# Altium schematic sheet Power.SchDoc
size A3
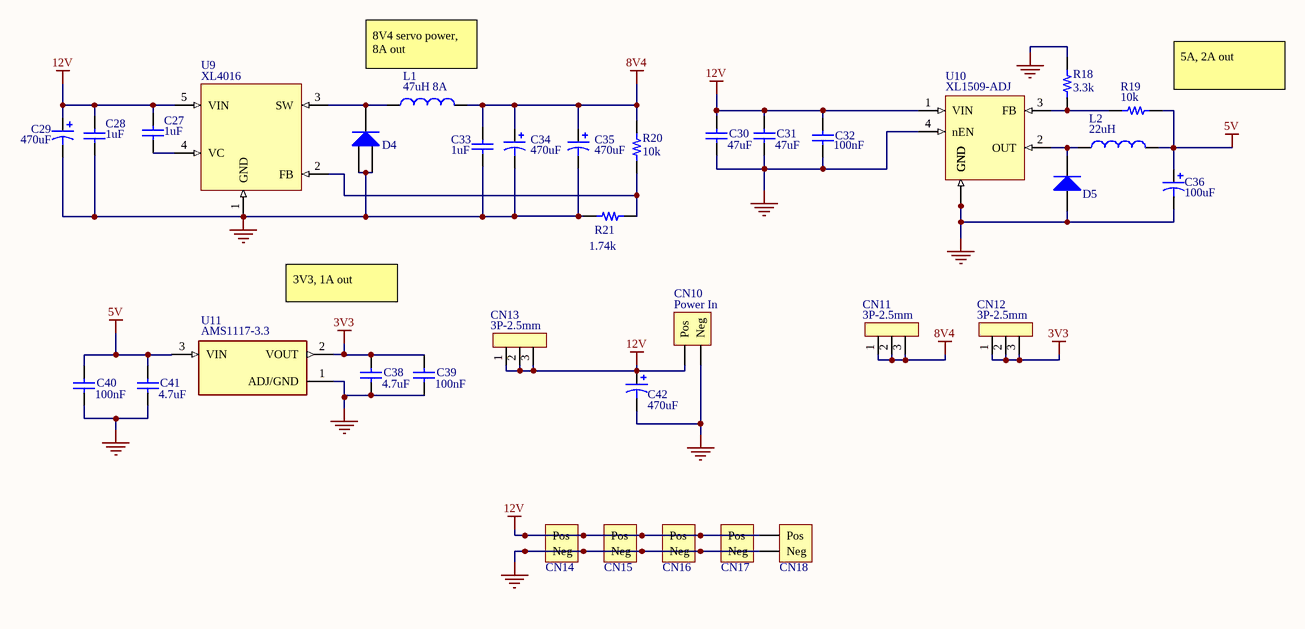
[diagram p0: Power.SchDoc]

## Parts
C27  value 1uF  [0402]  (hidden comment: Cap)
C28  value 1uF  [0402]  (hidden comment: Cap)
C29  470uF  [10x12mm-Electrolytic]
C30  value 47uF  [1206]  (hidden comment: Cap)
C31  value 47uF  [1206]  (hidden comment: Cap)
C32  value 100nF  [0402]  (hidden comment: Cap)
C33  value 1uF  [0402]  (hidden comment: Cap)
C34  470uF  [10x12mm-Electrolytic]
C35  470uF  [10x12mm-Electrolytic]
C36  100uF  [10x12mm-Electrolytic]
C38  value 4.7uF  [0805 - duplicate]  (hidden comment: Cap)
C39  value 100nF  [0402]  (hidden comment: Cap)
C40  value 100nF  [0402]  (hidden comment: Cap)
C41  value 4.7uF  [0805 - duplicate]  (hidden comment: Cap)
C42  470uF  [10x12mm-Electrolytic]
CN10  Power In  [Power_Leads]
CN11  3P-2.5mm  [2.5mm-3P]
CN12  3P-2.5mm  [2.5mm-3P]
CN13  3P-2.5mm  [2.5mm-3P]
CN14  JST_Leads_In  [Power_Leads]  (value not drawn)
CN15  JST_Leads_In  [Power_Leads]  (value not drawn)
CN16  JST_Leads_In  [Power_Leads]  (value not drawn)
CN17  JST_Leads_In  [Power_Leads]  (value not drawn)
CN18  JST_Leads_In  [Power_Leads]  (value not drawn)
D4  Diode  [PowerDi5]  (value not drawn)
D5  SS24  [DO-214AA]  (value not drawn)
L1  47uH 8A  [18x16-9-Inductor]
L2  22uH  [71x66-Inductor]
R18  3.3k  [0805 - duplicate]
R19  10k  [0805 - duplicate]
R20  10k  [0805 - duplicate]
R21  1.74k  [0805 - duplicate]
U9  XL4016  [TO220-5L]
U10  XL1509-ADJ  [SOP8-MT3420]
U11  AMS1117-3.3  [SOT229P700X180-4N]

## Nets
3V3: C38.2 C39.2 CN12.1 CN12.2 CN12.3 U11.2(VOUT)
5V: C36.1 C40.2 C41.2 L2.2 R19.2 U11.3(VIN)
8V4: C33.2 C34.1 C35.1 CN11.1 CN11.2 CN11.3 L1.2 R20.2
12V: C27.2 C28.2 C29.1 C30.2 C31.2 C32.2 C42.1 CN10.A(Pos) CN13.1 CN13.2 CN13.3 CN14.A(Pos) CN15.A(Pos) CN16.A(Pos) CN17.A(Pos) CN18.A(Pos) U9.5(VIN) U10.1(VIN)
GND: C28.1 C29.2 C30.1 C31.1 C32.1 C33.1 C34.2 C35.2 C36.2 C38.1 C39.1 C40.1 C41.1 C42.2 CN10.K(Neg) CN14.K(Neg) CN15.K(Neg) CN16.K(Neg) CN17.K(Neg) CN18.K(Neg) D4.1(A) D4.2(A) D5.A R18.2 R21.1 U9.1(GND) U10.4(nEN) U10.5(GND) U10.6(GND) U10.7(GND) U10.8(GND) U11.1(ADJ/GND)
NetC27_1: C27.1 U9.4(VC)
NetD4_3: D4.3(K) L1.1 U9.3(SW)
NetD5_K: D5.K L2.1 U10.2(OUT)
NetR18_1: R18.1 R19.1 U10.3(FB)
NetR20_1: R20.1 R21.2 U9.2(FB)

## Notes on the sheet
- (near L1) 8V4 servo power, 8A out
- (near R19) 5A, 2A out
- 3V3, 1A out

## Library data of the parts
C29 C34-C36 C42 = Polarised Capacitor
CN10 = JST_Leads_In
D5 = SS24: 2A Schottky Diode
L1 = SMD Inductor 18x16.9: TMPC1707
L2 = 22uH Inductor, 7.1*6.6
R18-R21 = Resistor
U9 = XL4016: 8A Buck COnverter
U10 = XL1509-5
U11 = AMS1117-3.3: Sot223/Pkg 1-Amp 3.3-Volt Low Drop Out Voltage Regulatator; MF: Advanced Monolithic Systems; Price: None; Package: None; Value: *; MP: AMS1117-3.3; Availability: Unavailable; SnapEDA_Link: https://www.snapeda.com/parts/AMS1117-3.3/Advanced%20Monolithic%20Systems/view-part/53450/?ref=snap
C27 C28 C30-C33 C38-C41 = Cap: Published: 8-Jun-2000; LatestRevisionDate: 17-Jul-2002; LatestRevisionNote: Re-released for DXP Platform.; PackageReference: RAD-0.3; Publisher: Altium Limited; PackageDescription: Radial Cap, Thru-Hole; 2 Leads; 0.3 in Pin Spacing
D4 = Diode: Published: 8-Jun-2000; LatestRevisionDate: 17-Jul-2002; LatestRevisionNote: Re-released for DXP Platform.; PackageVersion: Sep-1996; PackageReference: SMC; Publisher: Altium Limited; PackageDescription: DO-214-AB/SMC; 2 C-Bend Leads; Body 7.9 x 5.9 mm, inc. leads (LxW); Code_JEDEC: DO-214-AB